# Altium schematic sheet BUZZER_RELAY.SchDoc
size A; SheetNumber: 8; SheetTotal: 9
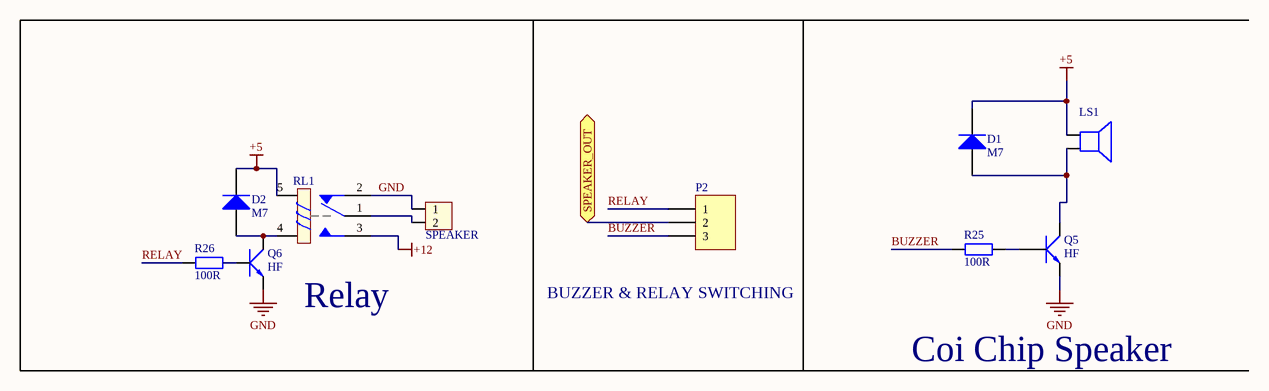
[diagram p0: BUZZER_RELAY.SchDoc]

## Parts
D1  M7  [DIODE SMA]
D2  M7  [DIODE SMA]
H1  SPEAKER  [XH2.54M-2]
LS1  Coi Chip Speaker  [Coi Chip Speacker]
P2  BUZZER & RELAY SWITCHING  [HDR1X3]
Q5  HF  [SOT23]
Q6  HF  [SOT23]
R25  100R  [tro smd 0603]
R26  100R  [tro smd 0603]
RL1  Relay  [Relay 5 Chan SRD]

## Ports
SPEAKER_OUT (bidir)

## Nets
+5: D1.2(K) D2.2(K) LS1.1 RL1.5
+12: RL1.3
GND: H1.1 Q5.2(E) Q6.2(E) RL1.2
BUZZER: P2.3 R25.1
RELAY: P2.1 R26.1
SPEAKER_OUT: P2.2 ; port SPEAKER_OUT
NetD1_1: D1.1(A) LS1.2 Q5.3(C)
NetD2_1: D2.1(A) Q6.3(C) RL1.4
NetH1_2: H1.2 RL1.1
NetQ5_1: Q5.1(B) R25.2
NetQ6_1: Q6.1(B) R26.2

## Library data of the parts
D1 D2 = Diode M7 ( 4007 ): Dán; Don_Vi: Con; Ten_Linh_Kien: Diode M7 1N4007 SMD 1A 1000V; Ma_Hang: MH000944; Chung_Loai: Dán; Ghi_Chu: *
H1 = Header 2P 2.54 Duc Thang: Cắm; Ten_Linh_Kien: Header 2P XH2.54-2P Đực Thẳng; Don_Vi: Con; Ma_Hang: MH001283; Chung_Loai: Cắm
LS1 = Coi Chip Speaker: Còi chip
P2 = Header 3: Header, 3-Pin; LatestRevisionDate: 17-Jul-2002; LatestRevisionNote: Re-released for DXP Platform.; Publisher: Altium Limited
Q5 Q6 = C1815 HF SMD: NPN transistor; Value: C9014
R25 R26 = Tro 0603 5% 100R: Dán; Don_Vi: Con; So_Chan: 2; Ten_Linh_Kien: Trở 0603 5% 100R; Ma_Hang: MH006315; Chung_Loai: Dán; Kieu_Chan: *
RL1 = Relay 5 Chan SRD: Relay 5 Chan; Ma_Hang: MH009374; Ten: Relay 5V10A SRD-05VDC-SL-C Chính Hãng